# EAGLE design working (EAGLE 9.5.1)
COMPANY: ADAFRUIT INDUSTRIES; DRAWN: KTOWN; REV: A
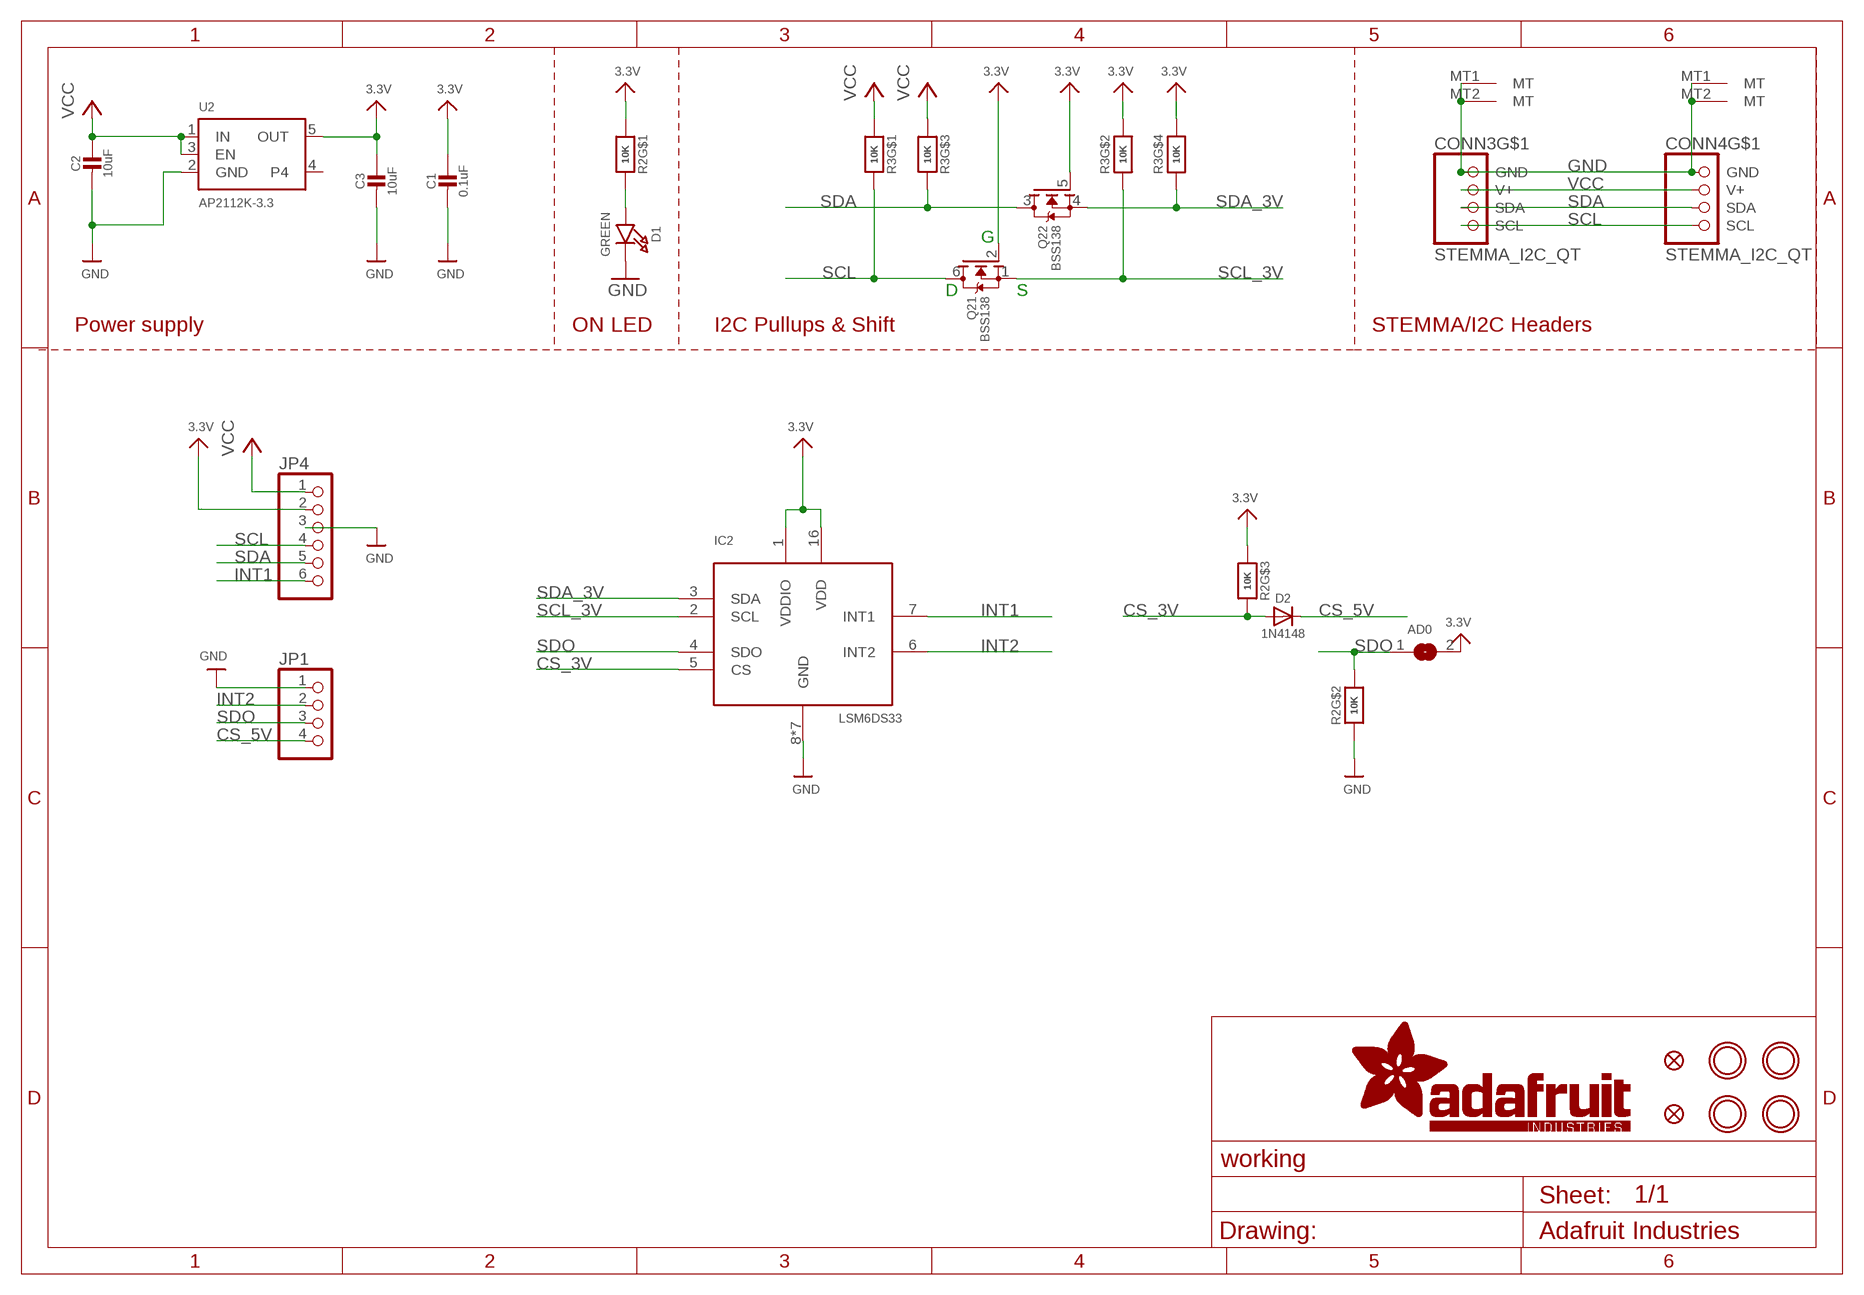
[diagram p0: schematic, sheet 1]

## Parts
AD0  SOLDERJUMPER  [SOLDERJUMPER_ARROW_NOPASTE]
C1  0.1uF  CAP_CERAMIC0603_NO  [0603-NO]
C2  10uF  CAP_CERAMIC0805-NOOUTLINE  [0805-NO]
C3  10uF  CAP_CERAMIC0805-NOOUTLINE  [0805-NO]
CONN3  STEMMA_I2C_QT  [JST_SH4]
CONN4  STEMMA_I2C_QT  [JST_SH4]
D1  GREEN  LED0603_NOOUTLINE  [CHIPLED_0603_NOOUTLINE]
D2  1N4148  DIODESOD-323  [SOD-323]
FID3  FIDUCIAL_1MM  [FIDUCIAL_1MM]
FID4  FIDUCIAL_1MM  [FIDUCIAL_1MM]
IC2  LSM6DS33  [LGA16_3X3MM]
JP1  HEADER-1X4ROUND  [1X04_ROUND]
JP4  HEADER-1X670MIL  [1X06_ROUND_70]
Q2  BSS138  MOSFET-N_DUAL  [SOT363]
R2  10K  RESISTOR_4PACK  [RESPACK_4X0603]
R3  10K  RESISTOR_4PACK  [RESPACK_4X0603]
U2  AP2112K-3.3  VREG_SOT23-5  [SOT23-5]
U$1  MOUNTINGHOLE2.5  [MOUNTINGHOLE_2.5_PLATED]
U$17  MOUNTINGHOLE2.5  [MOUNTINGHOLE_2.5_PLATED]
U$19  MOUNTINGHOLE2.5  [MOUNTINGHOLE_2.5_PLATED]
U$21  MOUNTINGHOLE2.5  [MOUNTINGHOLE_2.5_PLATED]

## Nets
3.3V [lowpower]: AD0.2 C1.1 C3.1 IC2.1(VDDIO) IC2.16(VDD) JP4.2 Q2.2(1:G) Q2.5(2:G) R2.1 R2.3 R3.2 R3.4 U2.5(OUT)
CS_3V: D2.A IC2.5(CS) R2.6
CS_5V: D2.C JP1.4
GND: C1.2 C2.2 C3.2 CONN3.1(GND) CONN3.MT1(MT) CONN3.MT2(MT) CONN4.1(GND) CONN4.MT1(MT) CONN4.MT2(MT) D1.C IC2.8(GND) IC2.9(GND) IC2.10(GND) IC2.11(GND) IC2.12(GND) IC2.13(GND) IC2.15(GND) JP1.1 JP4.3 R2.2 U2.2(GND)
INT1: IC2.7(INT1) JP4.6
INT2: IC2.6(INT2) JP1.2
N$1: D1.A R2.8
SCL: CONN3.4(SCL) CONN4.4(SCL) JP4.4 Q2.6(1:D) R3.8
SCL_3V: IC2.2(SCL) Q2.1(1:S) R3.7
SDA: CONN3.3(SDA) CONN4.3(SDA) JP4.5 Q2.3(2:D) R3.6
SDA_3V: IC2.3(SDA) Q2.4(2:S) R3.5
SDO: AD0.1 IC2.4(SDO) JP1.3 R2.7
VCC [highpower]: C2.1 CONN3.2(V+) CONN4.2(V+) JP4.1 R3.1 R3.3 U2.1(IN) U2.3(EN)
Unconnected: R2.4 R2.5 U2.4

## Notes on the sheet
- G
- D | S
- Power supply | ON LED | I2C Pullups & Shift | STEMMA/I2C Headers

## Library data of the parts
AD0 = microbuilder:SOLDERJUMPER: SMD Solder JUMPER Solder the two pads together to create a connection, or remove the solder to break it. REFLOW - Use this footprint for solder paste and reflow ovens. WAVE - Use this footprint for hand-soldering (larger pads). CLOSED - Has a trace between the two pads to ensure it is closed by default. The trace needs to be cut to disable the jumper, and can be closed again by creating a solder bridge between the two pads.; BOM: EXCLUDE
C1-C3 = microbuilder:CAP_CERAMIC: Ceramic Capacitors For new designs, use the packages preceded by an '_' character since they are more reliable: The following footprints should be used on most boards: _0402 - Standard footprint for regular board layouts _0603 - Standard footprint for regular board layouts _0805 - Standard footprint for regular board layouts _1206 - Standard footprint for regular board layouts For extremely tight-pitch boards where space is at a premium, the following 'micro-pitch' footprints can be used (smaller pads, no silkscreen outline, etc.): _0402MP - Micro-pitch footprint for very dense/compact boards _0603MP - Micro-pitch footprint for very dense/compact boards _0805MP - Micro-pitch footprint for very dense/compact boards _1206MP - Micro-pitch footprint for very dense/compact boards
CONN3 CONN4 = microbuilder:STEMMA_I2C
D1 = microbuilder:LED: LED 0603 - 0603 Surface Mount Package 2mA: Green LED - Low Power (3.9mcd, 2ma, 1.7Vf) - Digikey: 475-2709-2-ND Orange LED - Low Power (9.8mcd, 2ma, 1.8Vf) - Digikey: 475-1194-2-ND Red LED - Low Power (5mcd, 2ma, 1.8Vf) - Digikey: 475-1195-2-ND Yellow LED - Low Power (7mcd, 2ma, 1.8Vf) - Digikey: 475-1196-2-ND 5mA: Blue LED - Low Power (17mcd, 5ma, 2.9Vf) - Digikey: LNJ937W8CRACT-ND 0805 - 0805 Surface Mount Package 2mA: Red LED (8.8mcd, 2mA, 1.8Vf, Clear) - Low Power [Digikey: 475-2510-1-ND] Green LED (5mcd, 2mA, 1.8Vf, Clear) - Low Power [Digikey: 475-2730-1-ND] Yellow LED (11.3mcd, 2mA, 1.8Vf, Clear) - Low Power [Digikey: 475-2555-1-ND] 20mA: Red LED (104mcd, 20mA, Diffused) - LS R976 [Digikey: 475-1278-6-ND] Red LED (12mcd, 20mA, 2.0Vf, Clear) - APT2012EC [Digikey: 754-1128-1-ND] Green LED (15mcd, 20mA, 2.2Vf, Clear) - APT2012GC [Digikey: 754-1131-1-ND] Orange LED (160mcd, 20mA, 2.1Vf, Clear) - APT2012SECK [Digikey: 754-1130-1-ND] 1206 - 1206 Surface Mount Package Green LED (26mcd, 20mA, Diffused) - LG N971 [Digikey: 475-1407-6-ND] Red LED (15mcd, 20mA, Diffused) - LH N974 [Digikey: 475-1416-6-ND] Cree - Cree High-Power Surface Mount LEDs XPEBWT-L1-0000-00D50 - White 111lm 350mA 2.9Vf 6200K 110° XTEAWT-00-0000-00000LEE3 - White 114lm 350mA 2.85Vf 5000K 115° Everlight - Everlight 45-21 Series Surface Mount LEDs 45-21/QK2C-B2832AC2CB2/2T - Warm White 2000mcd 20mA 3.25Vf 3050K 120° 45-21/LK2C-B38452C4CB2/2T - Nuetral White 2000mcd 20mA 3.25Vf 4150K 120° 45-21/LK2C-B50634C6CB2/2T - Cold White 2200mcd 20mA 3.25Vf 5650K 120° PLCC2 Reverse Mount LS T77K-J1L2-1-0-2-R18-Z - Red 11.25mcd 2mA 1.8Vf 630nm 120° LO T77K-L1M2-24-Z - Orange 19.6mcd 2mA 1.8Vf 606nm 120° LY T77K-K2M1-26-Z - Yellow 15.7mcd 2mA 1.8Vf 587nm 120°
D2 = microbuilder:DIODE: Diode SMA Model Volts Amps Type Vf Ir Digikey # Notes SSA34-E3 40V 3A Schottky 480mV @ 3A 200uA @ 40V SSA34-E3/61TGITR-ND CDBA120-G 20V 1A Schottky 500mV @ 1A 500uA @ 20V 641-1014-6-ND REEL MBRA210 10V 2A Schottky 350mV @ 2A 700uA @ 10V MBRA210LT3 SOD-123 Model Volts Amps Type Vf Ir Order # Notes BAT54T1G 30V 200mA Schottky 800mV @ 200mA 2uA @ 25V BAT54T1GOSTR-ND B0530W 30V 500mA Schottky 430mV @ 500mA 130uA @ 30V B0530W-FDICT-ND REEL MBR120 20V 1A Schottky 340mV @ 1A MBR120VLSFT1GOSCT-ND SOD-323 Model Volts Amps Type Vf Ir Order # Notes PMEG2005EJ 20V 500mA Schottky 355mV @ 500mA 568-4110-1-ND ZLLS410 10V 570mA Schottky 380mV @ 570mA ZLLS410CT-ND 1N4148WS 75V 150mA Silicon/Simple 1V 1N4148WSFSCT-ND REEL SOD-523 Model Volts Amps Type Vf Ir Order # Notes BAT54XV2 30V 200mA Schottky 0.8V @ 100mA BAT54XV2CT-ND TB751S 30V 30mA Schottky RB751S-40TE61CT-ND SOT23-R/W (R = Solder Paste/Reflow Ovens, W = Hand-Soldering) Model Volts Amps Type Vf Ir Order # Notes BAT54FILM 40V 300mA Schottky 497-7162-1-ND POWERDI-5 Model Volts Amps Type Vf Ir Order # Notes PDS560 60V 5A Schottky 670mV @ 5A 150uA @ 60V PDS560DICT-ND
FID3 FID4 = microbuilder:FIDUCIAL: Fiducial Alignment Points Various fiducial points for machine vision alignment.; BOM: EXCLUDE
IC2 = adafruit_sensor:LSM6DS33
JP1 = microbuilder:HEADER-1X4: PIN HEADER
JP4 = microbuilder:HEADER-1X6: PIN HEADER
Q2 = microbuilder:MOSFET-N_DUAL: Dual N-Channel MOSFET SOT363 (2.0x1.25mm) 2N7002PS - 60V, 320mA [Digikey: 568-5984-1-ND]
R2 R3 = microbuilder:RESISTOR_4PACK: Resistor Packs (4 resistors) 4 x 0603 10K 1/16W - Digikey: YC164J-10KCT-ND
U2 = microbuilder:VREG_SOT23-5: SOT23-5 Fixed Voltage Regulators Part Current Out V Out V In V Dropout θJA (°C/W) TJ (°C) Digikey Part No. ADP121 150mA 3.3V 3.4-5.5V 0.09V @ 150mA -- -- ADP121-AUJZ33R7CT-ND ADP121 150mA 3.0V 3.1-5.5V 0.09V @ 150mA -- -- ADP121-AUJZ30R7CT-ND ADP122 300mA 3.3V 3.4-5.5V 0.085V @ 300mA -- -- ADP122AUJZ-3.3-R7CT-ND ADP1712 300mA 3.3V 3.5-5.5V 0.17V @ 300mA -- -- ADP1712AUJZ-3.3-R7TR-ND AP7311 (Low Cost) 150mA 3.3V 3.5-6V 0.15V @ 150mA -- -- AP7311-33WG-7DICT-ND LD39015M18R 150mA 1.8V 1.9V-5.5V 0.08V @ 100mA -- -- 497-6977-1-ND LP2985A-33DBVR 150mA 3.3V 3.3-16V 0.28V @ 150mA 206 150 296-18479-1-ND MCP1824T-3302E/OT 300mA 3.3V 3.5V-6V 0.2V @ 300mA -- -- MCP1824T-3302E/OTCT-ND MIC5205-2.5YM5 TR 150mA 2.5V 2.7-16V 0.165V @ 150mA -- -- 576-1257-2-ND MIC5205-3.0YM5 TR 150mA 3.0V 3.2V-16V 0.165V @ 150mA -- -- 576-1258-2-ND MIC5205-3.3YM5 TR 150mA 3.3V 3.5V-16V 0.165V @ 150mA -- -- 576-1259-2-ND TPS780330220 150mA 3.3V+2.2V 3.6-5.5V 250mV Max -- -- 296-23332-1-ND TDA3663/N1,135 100mA 3.3V 3.5-45V 0.18V @ 50mA -- -- 568-5343-1-ND Max operating temp can be calculated using θJA, TJ (max junction temperature), and power in watts. Set the "Maximum Ambient Temperature" until it reaches TJ ("Max Junction Temperature"), which is the absolute limit for safe use of the regulator: Heat Sink Temperature Calculator <http://www.daycounter.com/Calculators/Heat-Sink-Temperature-Calculator.phtml> For example, With 12V source into a 3.3V LP2985 and a 30mA load, we are dissipating (12V-3.3V) * 0.03A = 0.261W. With a θJA of 206 °C/W, a TJ of 150°C, and 261mW we can safely use the chip without a heat sink up to 75°C (=147.1°C Junction Temperature).
U$1 U$17 U$19 U$21 = microbuilder:MOUNTINGHOLE: Mounting Hole For #2 screws (0.086"/2.18mm width, 0.094"/2.4mm hole) use 2.5mm; BOM: EXCLUDE

## Net classes
1 highpower: width 0.406 mm, drill 0.483 mm
2 lowpower: width 0.305 mm, drill 0.483 mm

## Board
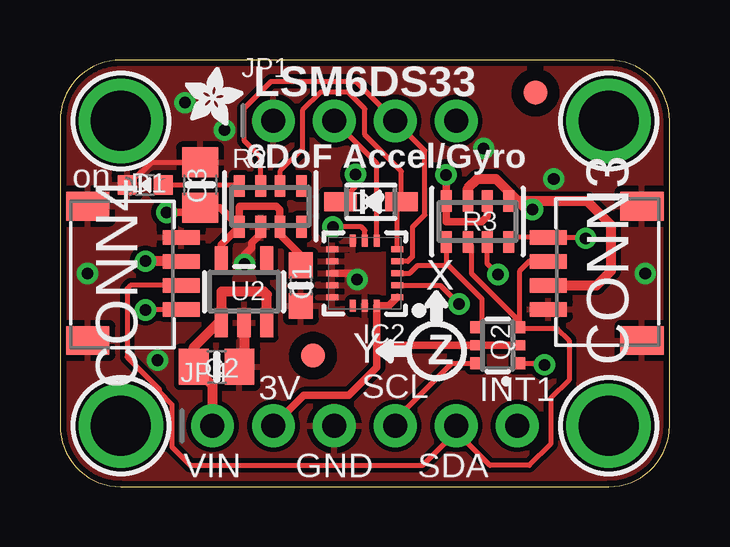
[diagram p1: board, top side]
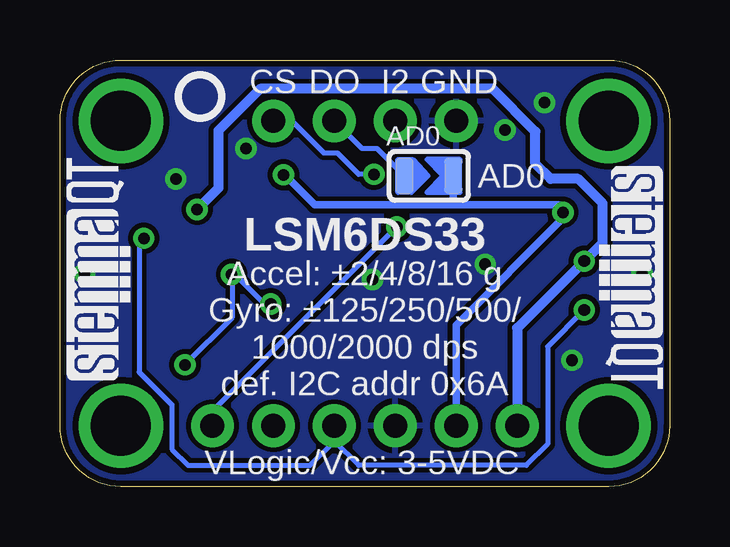
[diagram p2: board, bottom side, seen from below]

Size 25.4 x 17.78 mm. Coordinates in mm from the lower left corner, seen from the top.
Outline: 0,15.24 0,2.54 arc90 2.54,0 22.86,0 arc90 25.4,2.54 25.4,15.24 arc90 22.86,17.78 2.54,17.78 arc90 0,15.24
Copper layers (1*16): Top 0.035mm / dielectric 1.5mm / Bottom 0.035mm
Design rules "adafruit *": minimum track width 8mil, minimum drill 15.5mil, track to track 8mil, track to pad 8mil, pad to pad 8mil, via to via 8mil, smd to smd 8mil, copper to edge 10mil, drill to drill 8mil, minimum pad ring 10mil, minimum via ring 8mil, stop-mask expansion 2mil, vias tented up to drill 20mil, thermal gap 10mil

### Footprints (pad centres in the part's own frame; a part is rotated, then mirrored left to right if it is on the bottom)
SOLDERJUMPER_ARROW_NOPASTE = smd 0.762 x 1.524: 1 -1.016,0; 2 1.016,0
0603-NO = smd 1.075 x 1: 1 -0.85,0; 2 0.85,0
0805-NO = smd 1.24 x 1.5: 1 -0.95,0; 2 0.95,0
JST_SH4 = smd 0.6 x 1.55: 1 -1.5,2.514; 2 -0.5,2.514; 3 0.5,2.514; 4 1.5,2.514 | smd 1.2 x 1.8: MT1 -2.8,-1.386; MT2 2.8,-1.386
CHIPLED_0603_NOOUTLINE = smd 0.8 x 0.8: A 0,-0.75; C 0,0.75
SOD-323 = smd 1.35 x 0.8: A 1.27,0; C -1.27,0
FIDUCIAL_1MM = smd 1 x 1: 1 0,0
LGA16_3X3MM = smd 0.5 x 0.25: 1 -1.35,1; 2 -1.35,0.5; 3 -1.35,0; 4 -1.35,-0.5; 5 -1.35,-1; 9 1.35,-1; 10 1.35,-0.5; 11 1.35,0; 12 1.35,0.5; 13 1.35,1 | smd 0.25 x 0.5: 6 -0.5,-1.35; 7 0,-1.35; 8 0.5,-1.35; 14 0.5,1.35; 15 0,1.35; 16 -0.5,1.35
1X04_ROUND = drill 1 pad 1.778: 1 -3.81,0; 2 -1.27,0; 3 1.27,0; 4 3.81,0
1X06_ROUND_70 = drill 1 pad 1.778: 1 -6.35,0; 2 -3.81,0; 3 -1.27,0; 4 1.27,0; 5 3.81,0; 6 6.35,0
SOT363 = smd 0.5 x 0.5: 1 -0.75,-0.9; 3 0.75,-0.9; 4 0.75,0.9; 6 -0.75,0.9 | smd 0.4 x 0.5: 2 0,-0.9; 5 0,0.9
RESPACK_4X0603 = smd 0.45 x 0.9: 1 -1.3,-0.85; 2 -0.4,-0.85; 3 0.4,-0.85; 4 1.3,-0.85; 5 1.3,0.85; 6 0.4,0.85; 7 -0.4,0.85; 8 -1.3,0.85
SOT23-5 = smd 0.55 x 1.2: 1 -0.95,-1.3; 2 0,-1.3; 3 0.95,-1.3; 4 0.95,1.3; 5 -0.95,1.3
MOUNTINGHOLE_2.5_PLATED = drill 2.5 pad 3.2: P$1 0,0

### Placement (x,y rotation side)
AD0  10.03,12.95 0 bottom
C1  10.03,8.38 270 top
C2  6.53,4.99 0 top
C3  5.84,12.57 90 top
CONN3  22.86,8.89 90 top
CONN4  2.54,8.89 270 top
D1  3.56,12.57 90 top
D2  12.95,11.87 0 top
FID3  10.54,5.46 0 top
FID4  19.81,16.42 0 top
IC2  12.7,8.89 180 top
JP1  12.7,15.24 0 top
JP4  12.7,2.54 0 top
Q2  18.24,5.89 90 top
R2  8.76,11.68 0 top
R3  17.4,11.05 180 top
U2  7.67,8.13 0 top
U$1  2.54,15.24 0 top
U$9  [ADAFRUIT_2.5MM]  5.21,15.05 0 top
U$17  22.86,15.24 0 top
U$19  2.54,2.54 0 top
U$21  22.86,2.54 0 top
U$25  [PCBFEAT-REV-040]  19.56,16.26 0 bottom
U$30  [STEMMAQT]  22.48,4.45 90 bottom
U$31  [STEMMAQT]  2.92,13.34 270 bottom

### Tracks (layer width: path | path; a pad name or v marks a point on that pad's centre or on a via)
3.3V  (via drill 0.48)
  Top 0.305: Q2.2 Q2.5 13.28,5.89 13.2,5.97 | R2.1 6.67,11.62 C3.1 5.65,11.43 v4.45,11.43 | R2.1 6.72,10.09 U2.5 | JP4.2 10.16,3.81 12.03,3.81 13.2,4.98 13.2,5.97 | R2.1 7.46,11.65 7.49,11.68 9.02,11.68 9.16,11.54 R2.3 9.16,10.52 10.03,9.65 C1.1 | R3.2 17.8,11.27 17.58,11.05 16.1,11.05 R3.4 16.1,12.98 v16.09,13 | 13.2,5.97 IC2.16 13.7,7.54 IC2.1
  Bottom 0.305: 9.02,11.75 14.8,11.75 16.07,13.02 v16.09,13 | 9.02,11.75 4.64,11.75 4.45,11.56 v4.45,11.43 4.45,11.18 8.89,6.73 JP4.2 | AD0.2 9.02,11.75
CS_3V
  Top 0.203: IC2.5 14.05,11.7 D2.A 14.22,13.14 12.7,14.67 12.7,15.75 12,16.45 10.86,16.45 10.1,15.68 10.1,14.07 9.16,13.13 R2.6
CS_5V  (via drill 0.48)
  Top 0.203: v12.32,13.02 12.32,12.51 D2.C
  Bottom 0.203: v12.32,13.02 12.95,13.02 13.84,13.91 14.41,13.91 15.75,15.24 JP1.4
GND  (via drill 0.48)
  Top 0.203: D1.C 3.35,13.12 3.42,13.12 3.82,13.52 C3.2
  Top 0.305: R2.2 8.36,10.55 7.99,10.18 7.99,9.96 7.68,9.65 v7.68,9.27 | IC2.11 12.13,8.89 v12.38,8.64
  Top 0.406: U2.2 7.67,5.18 C2.2 7.63,5.14
  other vias: 1.14,8.89 5.21,16 24.38,8.89 20.57,12.83 4.06,5.27 17.65,14.1 6.86,14.86
  pour Top: 0,17.78 25.4,17.78 25.4,0 0,0
  pour Bottom: 0,17.78 25.4,17.78 25.4,0 0,0
INT1  (via drill 0.48)
  Top 0.203: IC2.7 12.7,10.68 12.56,10.83 v11.37,10.83
  Bottom 0.203: v11.37,10.83 19.05,3.14 JP4.6
INT2
  Top 0.203: IC2.6 13.2,13.47 JP1.2
N$1
  Top 0.203: R2.8 7.42,12.57 D1.A
SCL  (via drill 0.48)
  Top 0.203: JP4.4 13.97,2.79 16.32,5.14 Q2.6 | R3.8 18.89,10.39 CONN3.4 21.74,10.39 21.84,10.29 v21.91,10.35 | CONN4.4 5.03,7.37 v3.56,7.37 | Q2.6
  Bottom 0.203: v21.91,10.35 22.1,10.16 22.1,4.77 20.74,3.42 20.74,1.56 20.07,0.89 14.99,0.89 13.97,1.91 | 13.97,1.91 JP4.4 | v3.56,7.37 5.08,5.84 5.08,1.78 5.97,0.89 12.95,0.89 13.97,1.91
SCL_3V  (via drill 0.48)
  Top 0.203: v18.25,8.85 17.8,9.3 R3.7 | Q2.1 20.13,5.14 v20.19,5.08 | IC2.2 15.85,8.39 v16.62,7.62
  Bottom 0.203: v16.62,7.62 16.89,7.62 18.16,8.89 18.2,8.89 | 18.2,8.89 v18.25,8.85 | v20.19,5.08 18.2,7.07 18.2,8.89
SDA
  Top 0.203: CONN3.3 19.55,9.39 19.14,8.98 Q2.3 | R3.6 17.14,10.05 17.14,8.89 19.14,6.9 Q2.3 | Q2.3 19.18,6.6 20.7,6.6 21.21,6.1 21.21,4.45 20.45,3.68 20.45,1.78 19.56,0.89 17.91,0.89 16.51,2.29 | 16.51,2.29 JP4.5 | CONN4.3 2.93,8.39 2.79,8.26 2.79,5.4 4.13,4.06 4.13,3.95 4.66,3.42 4.66,1.66 5.43,0.89 15.11,0.89 16.51,2.29
SDA_3V
  Top 0.203: Q2.4 17.59,6.9 17.59,7.82 16.2,9.21 16.07,9.21 | IC2.3 14.57,8.89 14.89,9.21 16.07,9.21 | R3.5 16.1,9.24 16.07,9.21
SDO
  Top 0.203: R2.7 8.36,13.73 7.68,14.41 7.68,15.78 8.8,16.89 12.32,16.89 JP1.3 15.2,14.01 15.2,11.33 14.69,10.81 14.69,9.58 14.49,9.39 IC2.4
  Bottom 0.203: JP1.3 12.83,14.1 12.19,14.1 AD0.1
VCC  (via drill 0.48)
  Top 0.406: JP4.1 6.35,4.22 C2.1 5.58,5.82 6.59,6.83 U2.1 6.72,8.12 6.73,8.13 8.49,8.13 8.62,8 U2.3 | CONN3.2 22.36,8.39 22.96,8.99 22.96,10.9 21.96,11.9 R3.1 18.7,12.29 | R3.3 17,12.43 17.4,12.83 18.16,12.83 18.7,12.29 | 18.7,12.29 19.43,11.56 v19.68,11.56 | CONN4.2 v3.56,9.39 v3.56,9.4
  Bottom 0.406: v19.68,11.56 18.8,12.45 18.8,14.84 17.06,16.57 7.37,16.57 5.59,14.79 5.59,13.46 4.95,12.83 3.81,12.83 2.79,11.81 2.79,10.16 v3.56,9.4 6.35,6.6 JP4.1

### Text on the board
tPlace: LSM6DS33 | 6DoF Accel/Gyro | on | X | Y | Z | 3V | SCL | INT1 | VIN | GND | SDA
bPlace: GND | I2 | DO | CS | AD0 | LSM6DS33 | Accel: ±2/4/8/16 g / Gyro: ±125/250/500/ / 1000/2000 dps / def. I2C addr 0x6A | VLogic/Vcc: 3-5VDC